# EAGLE design Adafruit Perma Proto Pi - Half Size (EAGLE 6.4)
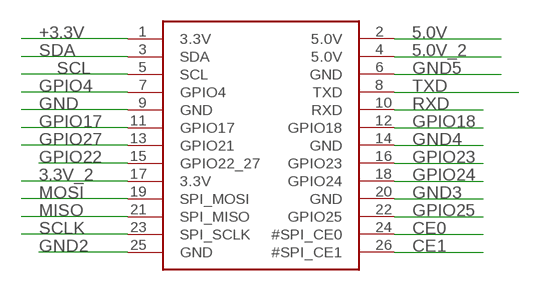
[diagram p0: schematic, sheet 1]

## Parts
JP1  RASBERRYPI_IDC  [RASBERRYPI_IDC]

## Nets
3.3V_2: JP1.17(3.3V)
5.0V: JP1.2(5.0V)
5.0V_2: JP1.4(5.0V)
+3.3V: JP1.1(3.3V)
CE0: JP1.24(#SPI_CE0)
CE1: JP1.26(#SPI_CE1)
GND: JP1.9(GND)
GND2: JP1.25(GND)
GND3: JP1.20(GND)
GND4: JP1.14(GND)
GND5: JP1.6(GND)
GPIO4: JP1.7(GPIO4)
GPIO17: JP1.11(GPIO17)
GPIO18: JP1.12(GPIO18)
GPIO22: JP1.15(GPIO22_27)
GPIO23: JP1.16(GPIO23)
GPIO24: JP1.18(GPIO24)
GPIO25: JP1.22(GPIO25)
GPIO27: JP1.13(GPIO21)
MISO: JP1.21(SPI_MISO)
MOSI: JP1.19(SPI_MOSI)
RXD: JP1.10(RXD)
SCL: JP1.5(SCL)
SCLK: JP1.23(SPI_SCLK)
SDA: JP1.3(SDA)
TXD: JP1.8(TXD)

## Library data of the parts
JP1 = microbuilder:RASBERRYPI_IDC: Rasberry PI IDC Header

## Board
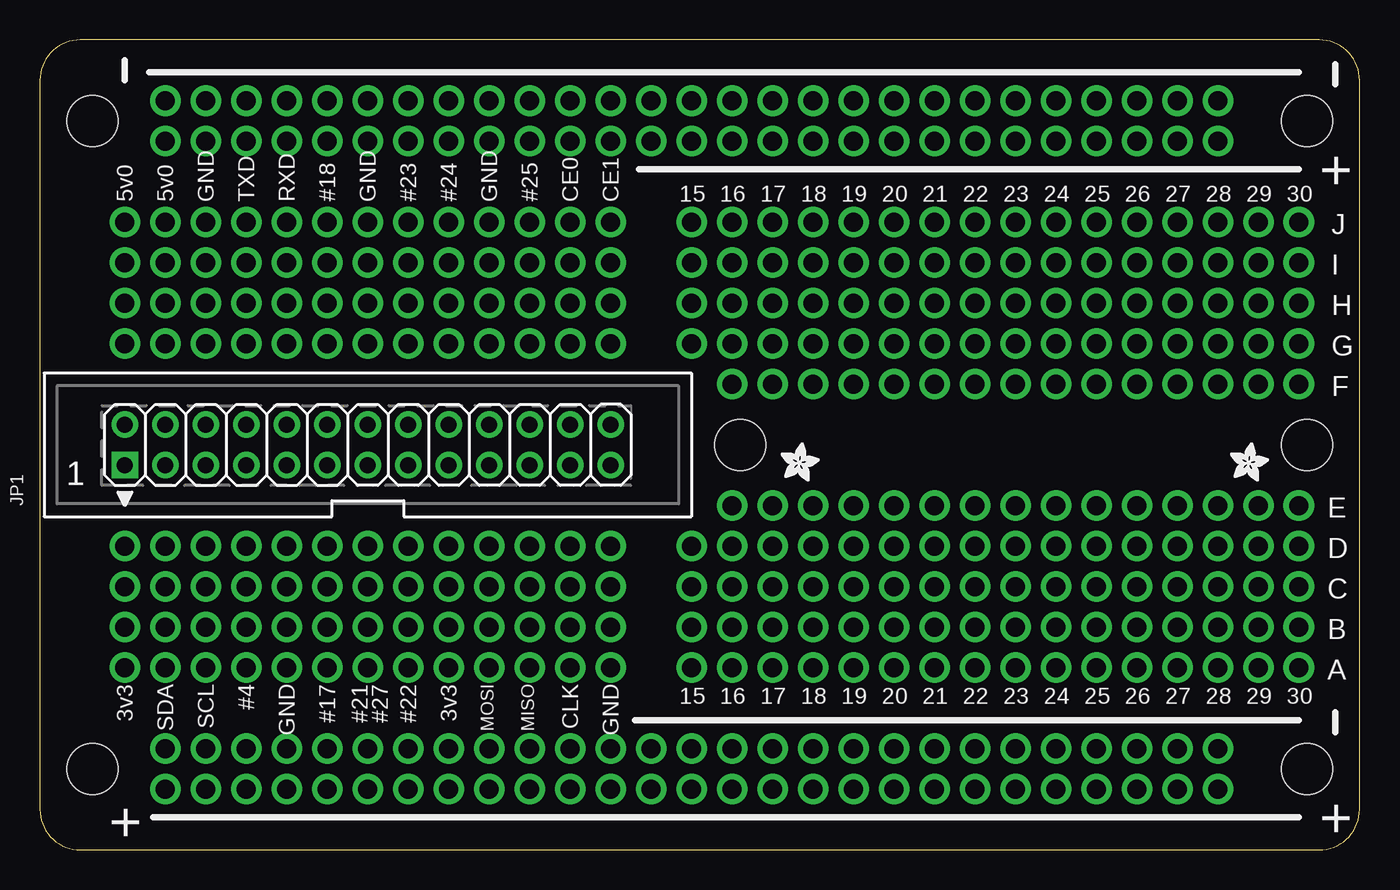
[diagram p1: board, top side]
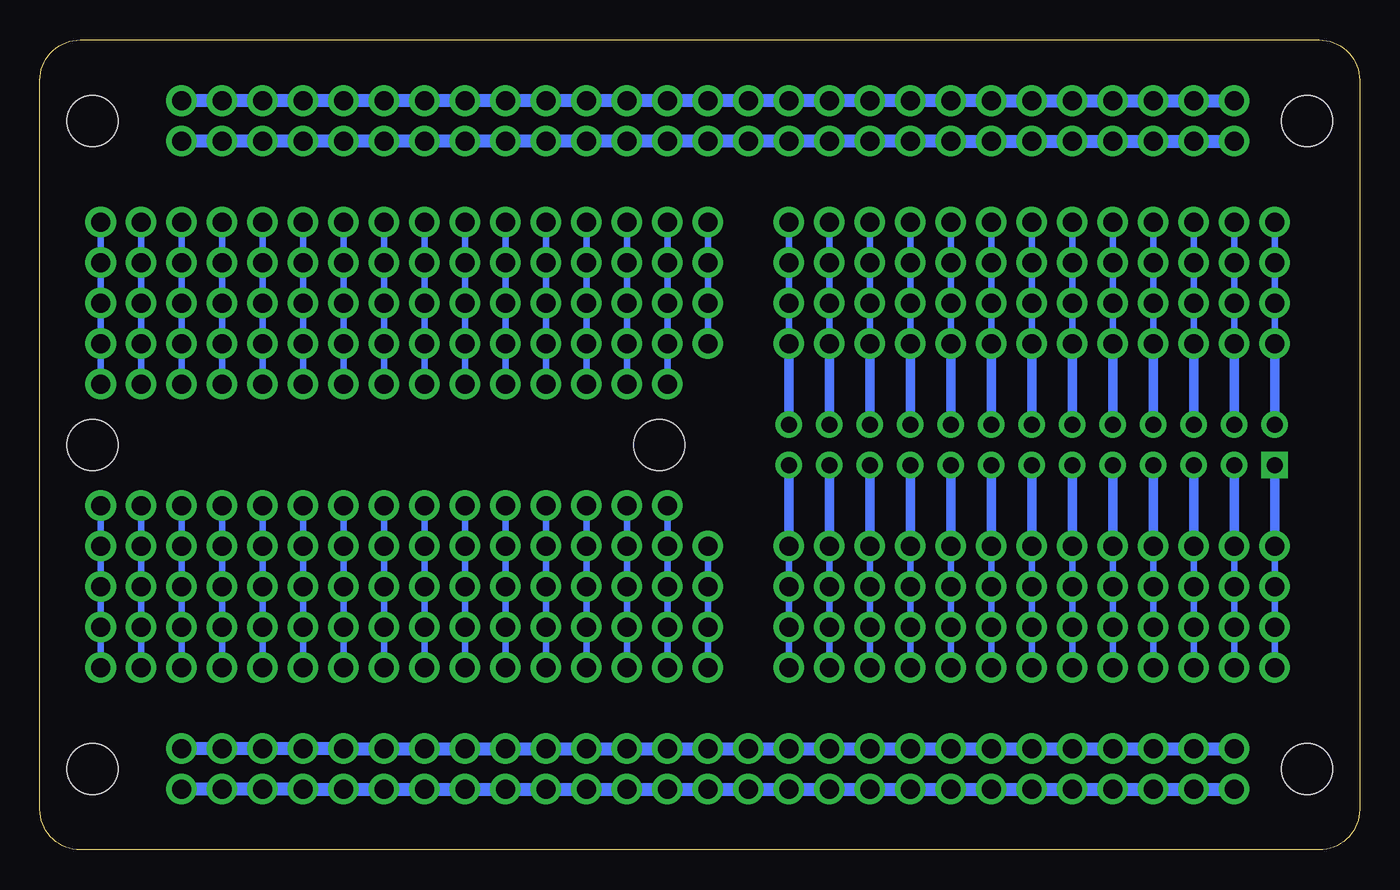
[diagram p2: board, bottom side, seen from below]

Size 82.8 x 50.8 mm. Coordinates in mm from the lower left corner, seen from the top.
Outline: 2.54,50.8 arc90 0,48.26 0,2.54 arc90 2.54,0 80.26,0 arc90 82.8,2.54 82.8,48.26 arc90 80.26,50.8 2.54,50.8
Copper layers (1*16): Top 0.035mm / dielectric 1.5mm / Bottom 0.035mm
Design rules "default": minimum track width 10mil, minimum drill 24mil, track to track 8mil, track to pad 8mil, pad to pad 8mil, via to via 8mil, smd to smd 8mil, copper to edge 40mil, drill to drill 8mil, minimum pad ring 10mil, minimum via ring 8mil, stop-mask expansion 4mil, vias tented up to drill 0mil, thermal gap 10mil
Holes 3.2 mm at 79.5,25.4 3.3,45.72 3.3,5.08 43.94,25.4 79.5,45.72 79.5,5.08

### Footprints (pad centres in the part's own frame; a part is rotated, then mirrored left to right if it is on the bottom)
RASBERRYPI_IDC = drill 1 pad 1.676 square: 1 -1.27,15.24 | drill 1 pad 1.676: 2 1.27,15.24; 3 -1.27,12.7; 4 1.27,12.7; 5 -1.27,10.16; 6 1.27,10.16; 7 -1.27,7.62; 8 1.27,7.62; 9 -1.27,5.08; 10 1.27,5.08; 11 -1.27,2.54; 12 1.27,2.54; 13 -1.27,0; 14 1.27,0; 15 -1.27,-2.54; 16 1.27,-2.54; 17 -1.27,-5.08; 18 1.27,-5.08; 19 -1.27,-7.62; 20 1.27,-7.62; 21 -1.27,-10.16; 22 1.27,-10.16; 23 -1.27,-12.7; 24 1.27,-12.7; 25 -1.27,-15.24; 26 1.27,-15.24

### Placement (x,y rotation side)
JP1  20.57,25.4 90 top
U$2  [ADAFRUIT_2.5MM]  46.48,23.11 0 top
U$3  [ADAFRUIT_2.5MM]  74.68,23.11 0 top

### Tracks (layer width: path | path; a pad name or v marks a point on that pad's centre or on a via)
3.3V_2  (via drill 1.2 pad 1.93)
  Bottom 0.406: v25.65,19.05 v25.65,16.51 v25.65,13.97 v25.65,11.43
  Bottom 0.61: v25.65,19.05 JP1.17
5.0V  (via drill 1.2 pad 1.93)
  Bottom 0.406: v5.33,39.37 v5.33,36.83 v5.33,34.29 v5.33,31.75
  Bottom 0.61: JP1.2 v5.33,31.75
5.0V_2  (via drill 1.2 pad 1.93)
  Bottom 0.406: v7.87,39.37 v7.87,36.83 v7.87,34.29 v7.87,31.75
  Bottom 0.61: JP1.4 v7.87,31.75
+3.3V  (via drill 1.2 pad 1.93)
  Bottom 0.406: v5.33,19.05 v5.33,16.51 v5.33,13.97 v5.33,11.43
  Bottom 0.61: JP1.1 v5.33,19.05
CE0  (via drill 1.2 pad 1.93)
  Bottom 0.406: v33.27,31.75 v33.27,34.29 v33.27,36.83 v33.27,39.37
  Bottom 0.61: JP1.24 v33.27,31.75
CE1  (via drill 1.2 pad 1.93)
  Bottom 0.406: v35.81,31.75 v35.81,34.29 v35.81,36.83 v35.81,39.37
  Bottom 0.61: v35.81,31.75 JP1.26
GND  (via drill 1.2 pad 1.93)
  Bottom 0.406: v15.49,19.05 v15.49,16.51 v15.49,13.97 v15.49,11.43
  Bottom 0.61: JP1.9 v15.49,19.05
GND2  (via drill 1.2 pad 1.93)
  Bottom 0.406: v35.81,19.05 v35.81,16.51 v35.81,13.97 v35.81,11.43
  Bottom 0.61: JP1.25 v35.81,19.05
GND3  (via drill 1.2 pad 1.93)
  Bottom 0.406: v28.19,31.75 v28.19,34.29 v28.19,36.83 v28.19,39.37
  Bottom 0.61: JP1.20 v28.19,31.75
GND4  (via drill 1.2 pad 1.93)
  Bottom 0.406: v20.57,39.37 v20.57,36.83 v20.57,34.29 v20.57,31.75
  Bottom 0.61: JP1.14 v20.57,31.75
GND5  (via drill 1.2 pad 1.93)
  Bottom 0.406: v10.41,31.75 v10.41,34.29 v10.41,36.83 v10.41,39.37
  Bottom 0.61: JP1.6 v10.41,31.75
GNDSTRIP1  (via drill 1.2 pad 1.93)
  Bottom 0.813: v7.87,46.99 v10.41,46.99 v12.95,46.99 v15.49,46.99 v18.03,46.99 v20.57,46.99 v23.11,46.99 v25.65,46.99 v28.19,46.99 v30.73,46.99 v33.27,46.99 v35.81,46.99 v38.35,46.99 v40.89,46.99 v43.43,46.99 v45.97,46.99 v48.51,46.99 v51.05,46.99 v53.59,46.99 v56.13,46.99 v58.67,46.99 v61.21,46.99 v63.75,46.99 v66.29,46.99 v68.83,46.99 v71.37,46.99 v73.91,46.99
GNDSTRIP2  (via drill 1.2 pad 1.93)
  Bottom 0.813: v7.87,6.35 v10.41,6.35 v12.95,6.35 v15.49,6.35 v18.03,6.35 v20.57,6.35 v23.11,6.35 v25.65,6.35 v28.19,6.35 v30.73,6.35 v33.27,6.35 v35.81,6.35 v38.35,6.35 v40.89,6.35 v43.43,6.35 v45.97,6.35 v48.51,6.35 v51.05,6.35 v53.59,6.35 v56.13,6.35 v58.67,6.35 v61.21,6.35 v63.75,6.35 v66.29,6.35 v68.83,6.35 v71.37,6.35 v73.91,6.35
GPIO4  (via drill 1.2 pad 1.93)
  Bottom 0.406: v12.95,11.43 v12.95,13.97 v12.95,16.51 v12.95,19.05
  Bottom 0.61: JP1.7 v12.95,19.05
GPIO17  (via drill 1.2 pad 1.93)
  Bottom 0.406: v18.03,11.43 v18.03,13.97 v18.03,16.51 v18.03,19.05
  Bottom 0.61: JP1.11 v18.03,19.05
GPIO18  (via drill 1.2 pad 1.93)
  Bottom 0.406: v18.03,31.75 v18.03,34.29 v18.03,36.83 v18.03,39.37
  Bottom 0.61: JP1.12 v18.03,31.75
GPIO22  (via drill 1.2 pad 1.93)
  Bottom 0.406: v23.11,11.43 v23.11,13.97 v23.11,16.51 v23.11,19.05
  Bottom 0.61: JP1.15 v23.11,19.05
GPIO23  (via drill 1.2 pad 1.93)
  Bottom 0.406: v23.11,31.75 v23.11,34.29 v23.11,36.83 v23.11,39.37
  Bottom 0.61: JP1.16 v23.11,31.75
GPIO24  (via drill 1.2 pad 1.93)
  Bottom 0.406: v25.65,39.37 v25.65,36.83 v25.65,34.29 v25.65,31.75
  Bottom 0.61: JP1.18 v25.65,31.75
GPIO25  (via drill 1.2 pad 1.93)
  Bottom 0.406: v30.73,39.37 v30.73,36.83 v30.73,34.29 v30.73,31.75
  Bottom 0.61: v30.73,31.75 JP1.22
GPIO27  (via drill 1.2 pad 1.93)
  Bottom 0.406: v20.57,19.05 v20.57,16.51 v20.57,13.97 v20.57,11.43
  Bottom 0.61: JP1.13 v20.57,19.05
MISO  (via drill 1.2 pad 1.93)
  Bottom 0.406: v30.73,19.05 v30.73,16.51 v30.73,13.97 v30.73,11.43
  Bottom 0.61: v30.73,19.05 JP1.21
MOSI  (via drill 1.2 pad 1.93)
  Bottom 0.406: v28.19,19.05 v28.19,16.51 v28.19,13.97 v28.19,11.43
  Bottom 0.61: JP1.19 v28.19,19.05
N$15  (via drill 1.2 pad 1.93)
  Bottom 0.406: v40.89,11.43 v40.89,13.97 v40.89,16.51 v40.89,19.05
N$16  (via drill 1.2 pad 1.93)
  Bottom 0.406: v43.43,21.59 v43.43,19.05 v43.43,16.51 v43.43,13.97 v43.43,11.43
N$17  (via drill 1.2 pad 1.93)
  Bottom 0.406: v48.51,21.59 v48.51,19.05 v48.51,16.51 v48.51,13.97 v48.51,11.43
N$18  (via drill 1.2 pad 1.93)
  Bottom 0.406: v45.97,11.43 v45.97,13.97 v45.97,16.51 v45.97,19.05 v45.97,21.59
N$19  (via drill 1.2 pad 1.93)
  Bottom 0.406: v51.05,21.59 v51.05,19.05 v51.05,16.51 v51.05,13.97 v51.05,11.43
N$20  (via drill 1.2 pad 1.93)
  Bottom 0.406: v53.59,11.43 v53.59,13.97 v53.59,16.51 v53.59,19.05 v53.59,21.59
N$21  (via drill 1.2 pad 1.93)
  Bottom 0.406: v58.67,11.43 v58.67,13.97 v58.67,16.51 v58.67,19.05 v58.67,21.59
N$22  (via drill 1.2 pad 1.93)
  Bottom 0.406: v56.13,21.59 v56.13,19.05 v56.13,16.51 v56.13,13.97 v56.13,11.43
N$23  (via drill 1.2 pad 1.93)
  Bottom 0.406: v61.21,21.59 v61.21,19.05 v61.21,16.51 v61.21,13.97 v61.21,11.43
N$24  (via drill 1.2 pad 1.93)
  Bottom 0.406: v63.75,11.43 v63.75,13.97 v63.75,16.51 v63.75,19.05 v63.75,21.59
N$25  (via drill 1.2 pad 1.93)
  Bottom 0.406: v66.29,21.59 v66.29,19.05 v66.29,16.51 v66.29,13.97 v66.29,11.43
N$26  (via drill 1.2 pad 1.93)
  Bottom 0.406: v68.83,11.43 v68.83,13.97 v68.83,16.51 v68.83,19.05 v68.83,21.59
N$27  (via drill 1.2 pad 1.93)
  Bottom 0.406: v73.91,21.59 v73.91,19.05 v73.91,16.51 v73.91,13.97 v73.91,11.43
N$28  (via drill 1.2 pad 1.93)
  Bottom 0.406: v71.37,11.43 v71.37,13.97 v71.37,16.51 v71.37,19.05 v71.37,21.59
N$29  (via drill 1.2 pad 1.93)
  Bottom 0.406: v76.45,21.59 v76.45,19.05 v76.45,16.51 v76.45,13.97 v76.45,11.43
N$30  (via drill 1.2 pad 1.93)
  Bottom 0.406: v78.99,11.43 v78.99,13.97 v78.99,16.51 v78.99,19.05 v78.99,21.59
N$33  (via drill 1.2 pad 1.93)
  Bottom 0.406: v78.99,29.21 v78.99,31.75 v78.99,34.29 v78.99,36.83 v78.99,39.37
N$34  (via drill 1.2 pad 1.93)
  Bottom 0.406: v76.45,39.37 v76.45,36.83 v76.45,34.29 v76.45,31.75 v76.45,29.21
N$35  (via drill 1.2 pad 1.93)
  Bottom 0.406: v73.91,29.21 v73.91,31.75 v73.91,34.29 v73.91,36.83 v73.91,39.37
N$36  (via drill 1.2 pad 1.93)
  Bottom 0.406: v71.37,39.37 v71.37,36.83 v71.37,34.29 v71.37,31.75 v71.37,29.21
N$37  (via drill 1.2 pad 1.93)
  Bottom 0.406: v68.83,29.21 v68.83,31.75 v68.83,34.29 v68.83,36.83 v68.83,39.37
N$38  (via drill 1.2 pad 1.93)
  Bottom 0.406: v66.29,39.37 v66.29,36.83 v66.29,34.29 v66.29,31.75 v66.29,29.21
N$39  (via drill 1.2 pad 1.93)
  Bottom 0.406: v61.21,39.37 v61.21,36.83 v61.21,34.29 v61.21,31.75 v61.21,29.21
N$40  (via drill 1.2 pad 1.93)
  Bottom 0.406: v63.75,29.21 v63.75,31.75 v63.75,34.29 v63.75,36.83 v63.75,39.37
N$41  (via drill 1.2 pad 1.93)
  Bottom 0.406: v58.67,29.21 v58.67,31.75 v58.67,34.29 v58.67,36.83 v58.67,39.37
N$42  (via drill 1.2 pad 1.93)
  Bottom 0.406: v56.13,29.21 v56.13,31.75 v56.13,34.29 v56.13,36.83 v56.13,39.37
N$43  (via drill 1.2 pad 1.93)
  Bottom 0.406: v53.59,29.21 v53.59,31.75 v53.59,34.29 v53.59,36.83 v53.59,39.37
N$44  (via drill 1.2 pad 1.93)
  Bottom 0.406: v51.05,39.37 v51.05,36.83 v51.05,34.29 v51.05,31.75 v51.05,29.21
N$45  (via drill 1.2 pad 1.93)
  Bottom 0.406: v48.51,29.21 v48.51,31.75 v48.51,34.29 v48.51,36.83 v48.51,39.37
N$46  (via drill 1.2 pad 1.93)
  Bottom 0.406: v45.97,39.37 v45.97,36.83 v45.97,34.29 v45.97,31.75 v45.97,29.21
N$47  (via drill 1.2 pad 1.93)
  Bottom 0.406: v43.43,39.37 v43.43,36.83 v43.43,34.29 v43.43,31.75 v43.43,29.21
N$48  (via drill 1.2 pad 1.93)
  Bottom 0.406: v40.89,31.75 v40.89,34.29 v40.89,36.83 v40.89,39.37
PWRSTRIP1  (via drill 1.2 pad 1.93)
  Bottom 0.813: v7.87,44.45 v10.41,44.45 v12.95,44.45 v15.49,44.45 v18.03,44.45 v20.57,44.45 v23.11,44.45 v25.65,44.45 v28.19,44.45 v30.73,44.45 v33.27,44.45 v35.81,44.45 v38.35,44.45 v40.89,44.45 v43.43,44.45 v45.97,44.45 v48.51,44.45 v51.05,44.45 v53.59,44.45 v56.13,44.45 v58.67,44.45 v61.21,44.45 v63.75,44.45 v66.29,44.45 v68.83,44.45 v71.37,44.45 v73.91,44.45
PWRSTRIP2  (via drill 1.2 pad 1.93)
  Bottom 0.813: v7.87,3.81 v10.41,3.81 v12.95,3.81 v15.49,3.81 v18.03,3.81 v20.57,3.81 v23.11,3.81 v25.65,3.81 v28.19,3.81 v30.73,3.81 v33.27,3.81 v35.81,3.81 v38.35,3.81 v40.89,3.81 v43.43,3.81 v45.97,3.81 v48.51,3.81 v51.05,3.81 v53.59,3.81 v56.13,3.81 v58.67,3.81 v61.21,3.81 v63.75,3.81 v66.29,3.81 v68.83,3.81 v71.37,3.81 v73.91,3.81
RXD  (via drill 1.2 pad 1.93)
  Bottom 0.406: v15.49,39.37 v15.49,36.83 v15.49,34.29 v15.49,31.75
  Bottom 0.61: JP1.10 v15.49,31.75
SCL  (via drill 1.2 pad 1.93)
  Bottom 0.406: v10.41,19.05 v10.41,16.51 v10.41,13.97 v10.41,11.43
  Bottom 0.61: JP1.5 v10.41,19.05
SCLK  (via drill 1.2 pad 1.93)
  Bottom 0.406: v33.27,11.43 v33.27,13.97 v33.27,16.51 v33.27,19.05
  Bottom 0.61: v33.27,19.05 JP1.23
SDA  (via drill 1.2 pad 1.93)
  Bottom 0.406: v7.87,11.43 v7.87,13.97 v7.87,16.51 v7.87,19.05
  Bottom 0.61: JP1.3 v7.87,19.05
TXD  (via drill 1.2 pad 1.93)
  Bottom 0.406: v12.95,39.37 v12.95,36.83 v12.95,34.29 v12.95,31.75
  Bottom 0.61: JP1.8 v12.95,31.75

### Text on the board
tPlace: 5v0 | 5v0 | GND | TXD | RXD | #18 | GND | #23 | #24 | GND | #25 | CE0 | CE1 | 15 | 16 | 17 | 18 | 19 | 20 | 21 | 22 | 23 | 24 | 25 | 26 | 27 | 28 | 29 | 30 | J | I | H | G | F | E | D | C | B | 3v3 | SDA | SCL | #4 | GND | #17 | #21 | #27 | #22 | 3v3 | MOSI | MISO | CLK | GND | A | 15 | 16 | 17 | 18 | 19 | 20 | 21 | 22 | 23 | 24 | 25 | 26 | 27 | 28 | 29 | 30
tDocu: Adafruit PermaProto for Pi | Half-size Breadboard
tPlaceRed: + | + | +